# Altium schematic sheet Main.SchDoc
size A4
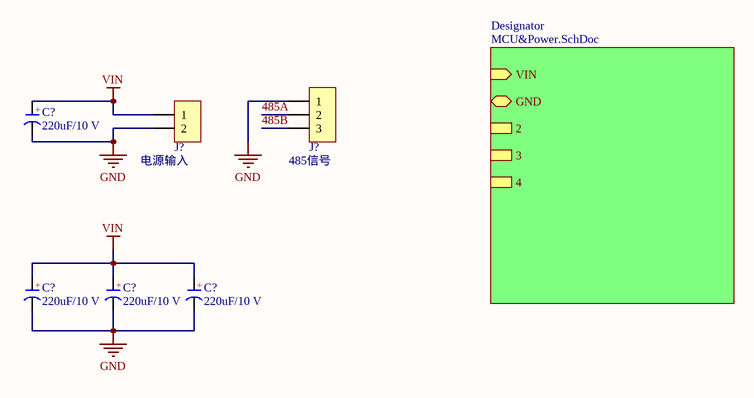
[diagram p0: Main.SchDoc]

## Parts
(Parts that share a designator on the sheet are numbered #1, #2 ... from top to bottom, then left to right.)
C?#1  220uF/10 V  [CAP 1.5*4*8]
C?#2  220uF/10 V  [CAP 1.5*4*8]
C?#3  220uF/10 V  [CAP 1.5*4*8]
C?#4  220uF/10 V  [CAP 1.5*4*8]
J?#1  HDR-1X3  [KF2EDGK5.0-WI-3P]  (value not drawn)
J?#2  HDR-1X2  [KF2EDGK5.0-WI-2P]  (value not drawn)

## Sub-sheets
Designator = MCU&Power.SchDoc: VIN (in), GND (bidir), 2, 3, 4

## Nets
GND: C?#1.2(K) C?#2.2(K) C?#3.2(K) C?#4.2(K) J?#1.1 J?#2.2
VIN: C?#1.1(A) C?#2.1(A) C?#3.1(A) C?#4.1(A) J?#2.1
485A: J?#1.2
485B: J?#1.3

## Notes on the sheet
- (near J?#2) 电源输入
- (near J?#1) 485信号
- (in symbol C-CAP) +

## Library data of the parts
C?#1-C?#4 = C-CAP: 直插电解电容; 版权归属: 源创客; BOM名称: 直插电解电容; 学习资源: www.ooocke.com
J?#1 = Header 3: 3P接插件; 版权归属: 源创客; BOM名称: 3P接插件; 学习资源: www.ooocke.com
J?#2 = Header 2: 2P接插件; 版权归属: 源创客; BOM名称: 2P接插件; 学习资源: www.ooocke.com